# EAGLE schematic rev1 (EAGLE 9.6.2)
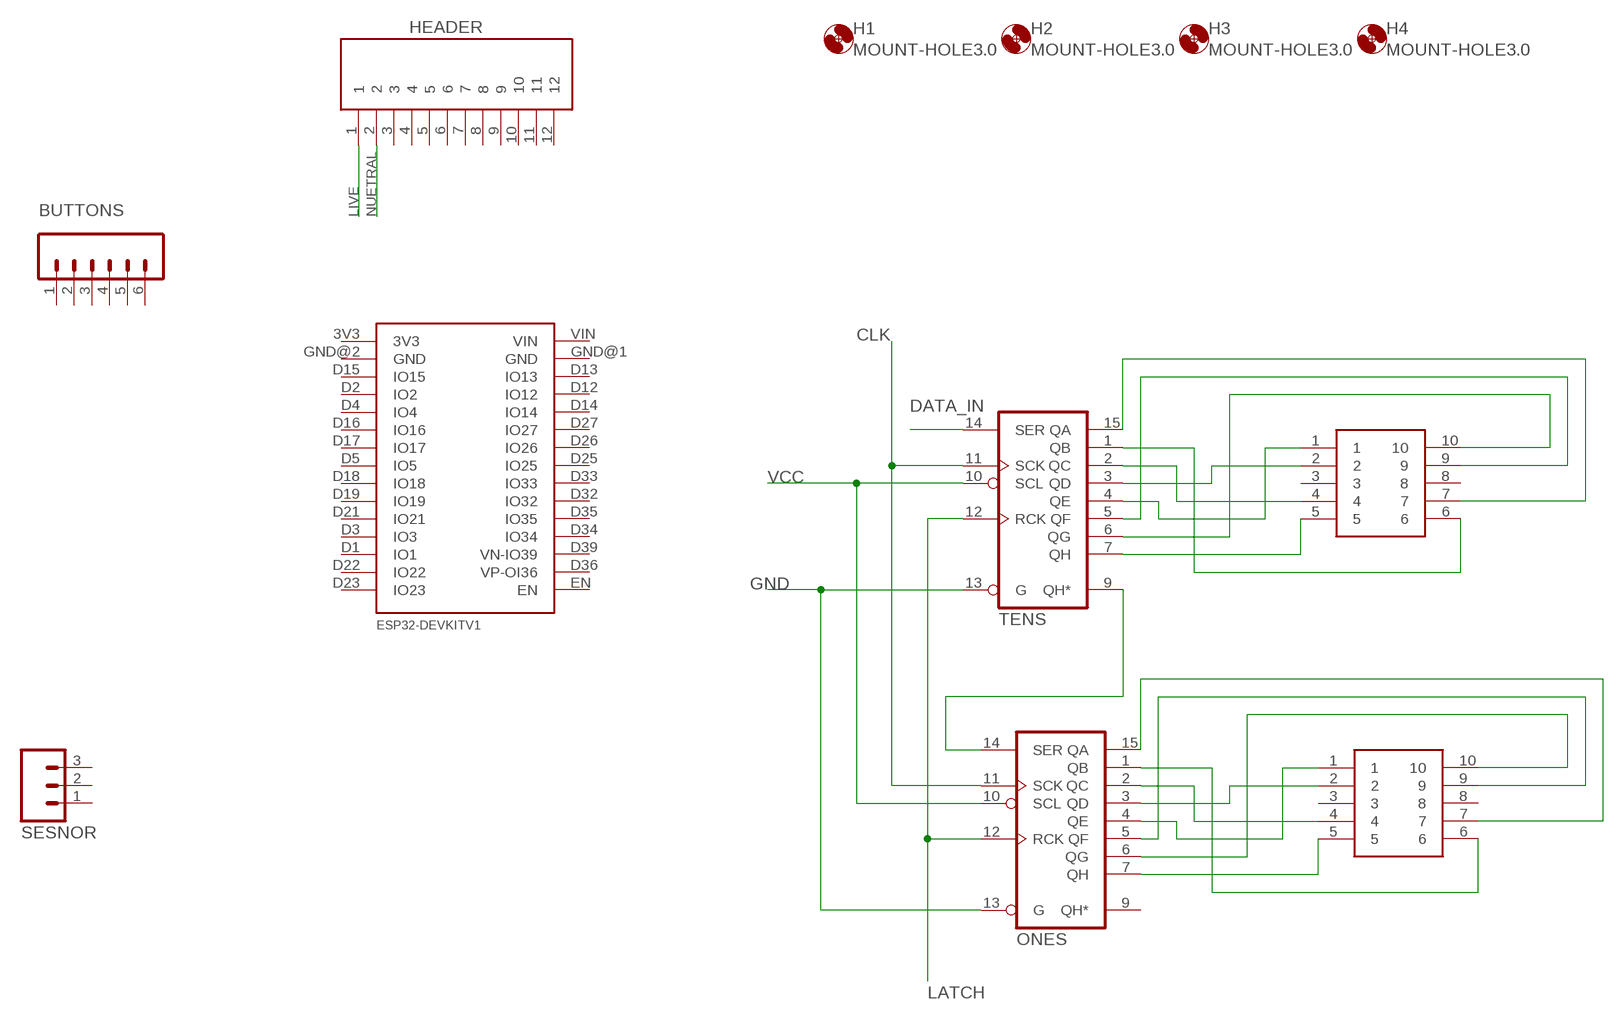
[diagram p0: schematic, sheet 1]

## Parts
BUTTONHEADER  CONN_06LONGPADS  [1X06_LONGPADS]
H1  MOUNT-HOLE3.0  [3,0]
H2  MOUNT-HOLE3.0  [3,0]
H3  MOUNT-HOLE3.0  [3,0]
H4  MOUNT-HOLE3.0  [3,0]
IC_ESP32  ESP32DEVKITV1  [ESP32-DEVKITV1]
MAINHEADER  TB005-762-12BE  [CUI_TB005-762-12BE]
ONES_7SEG  SC10-21SRWA  [DIPS3040W50P254L2400H1050Q10N]
ONES_SHIFTREG  74LS595N  [DIL16]
SENSOR  CONN_03LONGPADS  [1X03_LONGPADS]
TENS_7SEG  SC10-21SRWA  [DIPS3040W50P254L2400H1050Q10N]
TENS_SHIFTREG  74LS595N  [DIL16]

## Nets
CLK: ONES_SHIFTREG.11(SCK) TENS_SHIFTREG.11(SCK)
DATA_IN: TENS_SHIFTREG.14(SER)
GND: ONES_SHIFTREG.13(G) TENS_SHIFTREG.13(G)
LATCH: ONES_SHIFTREG.12(RCK) TENS_SHIFTREG.12(RCK)
LIVE: MAINHEADER.1
N$1: TENS_7SEG.7 TENS_SHIFTREG.15(QA)
N$2: TENS_7SEG.6 TENS_SHIFTREG.1(QB)
N$3: TENS_7SEG.4 TENS_SHIFTREG.2(QC)
N$4: TENS_7SEG.2 TENS_SHIFTREG.3(QD)
N$5: TENS_7SEG.1 TENS_SHIFTREG.4(QE)
N$6: TENS_7SEG.9 TENS_SHIFTREG.5(QF)
N$7: TENS_7SEG.10 TENS_SHIFTREG.6(QG)
N$8: TENS_7SEG.5 TENS_SHIFTREG.7(QH)
N$9: ONES_7SEG.7 ONES_SHIFTREG.15(QA)
N$10: ONES_7SEG.6 ONES_SHIFTREG.1(QB)
N$11: ONES_7SEG.4 ONES_SHIFTREG.2(QC)
N$12: ONES_7SEG.2 ONES_SHIFTREG.3(QD)
N$13: ONES_7SEG.1 ONES_SHIFTREG.4(QE)
N$14: ONES_7SEG.9 ONES_SHIFTREG.5(QF)
N$15: ONES_7SEG.10 ONES_SHIFTREG.6(QG)
N$16: ONES_7SEG.5 ONES_SHIFTREG.7(QH)
N$17: ONES_SHIFTREG.14(SER) TENS_SHIFTREG.9(QH*)
NUETRAL: MAINHEADER.2
VCC: ONES_SHIFTREG.10(SCL) TENS_SHIFTREG.10(SCL)
Unconnected: BUTTONHEADER.1 BUTTONHEADER.2 BUTTONHEADER.3 BUTTONHEADER.4 BUTTONHEADER.5 BUTTONHEADER.6 IC_ESP32.3V3 IC_ESP32.D1(IO1) IC_ESP32.D2(IO2) IC_ESP32.D3(IO3) IC_ESP32.D4(IO4) IC_ESP32.D5(IO5) IC_ESP32.D12(IO12) IC_ESP32.D13(IO13) IC_ESP32.D14(IO14) IC_ESP32.D15(IO15) IC_ESP32.D16(IO16) IC_ESP32.D17(IO17) IC_ESP32.D18(IO18) IC_ESP32.D19(IO19) IC_ESP32.D21(IO21) IC_ESP32.D22(IO22) IC_ESP32.D23(IO23) IC_ESP32.D25(IO25) IC_ESP32.D26(IO26) IC_ESP32.D27(IO27) IC_ESP32.D32(IO32) IC_ESP32.D33(IO33) IC_ESP32.D34(IO34) IC_ESP32.D35(IO35) IC_ESP32.D36(VP-OI36) IC_ESP32.D39(VN-IO39) IC_ESP32.EN IC_ESP32.GND@1(GND) IC_ESP32.GND@2(GND) IC_ESP32.VIN MAINHEADER.3 MAINHEADER.4 MAINHEADER.5 MAINHEADER.6 MAINHEADER.7 MAINHEADER.8 MAINHEADER.9 MAINHEADER.10 MAINHEADER.11 MAINHEADER.12 ONES_7SEG.3 ONES_7SEG.8 ONES_SHIFTREG.9(QH*) SENSOR.1 SENSOR.2 SENSOR.3 TENS_7SEG.3 TENS_7SEG.8

## Power pins joined to a net without a drawn wire
GND: ONES_SHIFTREG.8(GND) TENS_SHIFTREG.8(GND)
VCC: ONES_SHIFTREG.16(VCC) TENS_SHIFTREG.16(VCC)

## Library data of the parts
BUTTONHEADER = SparkFun-Connectors:CONN_06: Multi connection point. Often used as Generic Header-pin footprint for 0.1 inch spaced/style header connections On any of the 0.1 inch spaced packages, you can populate with these: Break Away Headers - Straight <https://www.sparkfun.com/products/116> (PRT-00116) Break Away Male Headers - Right Angle <https://www.sparkfun.com/products/553> (PRT-00553) Female Headers <https://www.sparkfun.com/products/115> (PRT-00115) Break Away Headers - Machine Pin <https://www.sparkfun.com/products/117> (PRT-00117) Break Away Female Headers - Swiss Machine Pin <https://www.sparkfun.com/products/743> (PRT-00743) Arduino Stackable Header - 6 Pin <https://www.sparkfun.com/products/9280> (PRT-09280) For SCREWTERMINALS and SPRING TERMINALS visit here: Screw Terimnals on SparkFun.com <https://www.sparkfun.com/search/results?term=Screw+Terminals> (5mm/3.5mm/2.54mm spacing) This device is also useful as a general connection point to wire up your design to another part of your project. Our various solder wires solder well into these plated through hole pads. Hook-Up Wire - Assortment (Stranded, 22 AWG) <https://www.sparkfun.com/products/11375> (PRT-11375) Hook-Up Wire - Assortment (Solid Core, 22 AWG) <https://www.sparkfun.com/products/11367> (PRT-11367) View the entire wire category on our website here <https://www.sparkfun.com/categories/141>
H1-H4 = holes:MOUNT-HOLE: MOUNTING HOLE with drill center marker
IC_ESP32 = ESP32-DEVKITV1:ESP32DEVKITV1
MAINHEADER = 12pinHeader:TB005-762-12BE; MANUFACTURER: CUI; STANDARD: Manufacturer Recommendations
ONES_7SEG TENS_7SEG = 7SEG:SC10-21SRWA: KINGBRIGHT - SC10-21SRWA - LED DISPLAY, 1.0", RED, CC Source: Datasheet <https://componentsearchengine.com/Datasheets/2/SC10-21SRWA.pdf>; DESCRIPTION: KINGBRIGHT - SC10-21SRWA - LED DISPLAY, 1.0", RED, CC; HEIGHT: 10.5mm; MANUFACTURER_NAME: Kingbright; MANUFACTURER_PART_NUMBER: SC10-21SRWA; MOUSER_PART_NUMBER: 604-SC10-21SRWA; MOUSER_PRICE-STOCK: https://www.mouser.co.uk/ProductDetail/Kingbright/SC10-21SRWA?qs=y3UkhjaxUTZrdOD1SRLzBw%3D%3D
ONES_SHIFTREG TENS_SHIFTREG = 74xx-us:74*595: 8-bit SHIFT REGISTER, output latch
SENSOR = SparkFun-Connectors:CONN_03: Multi connection point. Often used as Generic Header-pin footprint for 0.1 inch spaced/style header connections On any of the 0.1 inch spaced packages, you can populate with these: Break Away Headers - Straight <https://www.sparkfun.com/products/116> (PRT-00116) Break Away Male Headers - Right Angle <https://www.sparkfun.com/products/553> (PRT-00553) Female Headers <https://www.sparkfun.com/products/115> (PRT-00115) Break Away Headers - Machine Pin <https://www.sparkfun.com/products/117> (PRT-00117) Break Away Female Headers - Swiss Machine Pin <https://www.sparkfun.com/products/743> (PRT-00743) Stackable Header - 3 Pin (Female, 0.1") <https://www.sparkfun.com/products/13875> (PRT-13875) For SCREWTERMINALS and SPRING TERMINALS visit here: Screw Terimnals on SparkFun.com <https://www.sparkfun.com/search/results?term=Screw+Terminals> (5mm/3.5mm/2.54mm spacing) This device is also useful as a general connection point to wire up your design to another part of your project. Our various solder wires solder well into these plated through hole pads. Hook-Up Wire - Assortment (Stranded, 22 AWG) <https://www.sparkfun.com/products/11375> (PRT-11375) Hook-Up Wire - Assortment (Solid Core, 22 AWG) <https://www.sparkfun.com/products/11367> (PRT-11367) View the entire wire category on our website here <https://www.sparkfun.com/categories/141> Special notes: Molex polarized connector foot print use with SKU : PRT-08232 with associated crimp pins and housings.